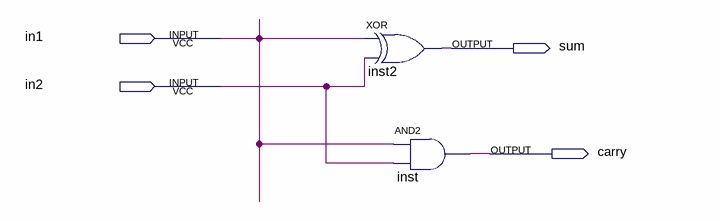
[diagram p0: schematic sheet]
// Quartus schematic ALU.bdf as structural Verilog: 2 symbols, 4 pins
module ALU (
  input  in1,
  input  in2,
  output sum,
  output carry
);

  xor inst2 (sum, in1, in2);
  and inst (carry, in1, in2);
endmodule
